# EAGLE design SignalMast-ColorLight-Dwarf (EAGLE 7.7.0)
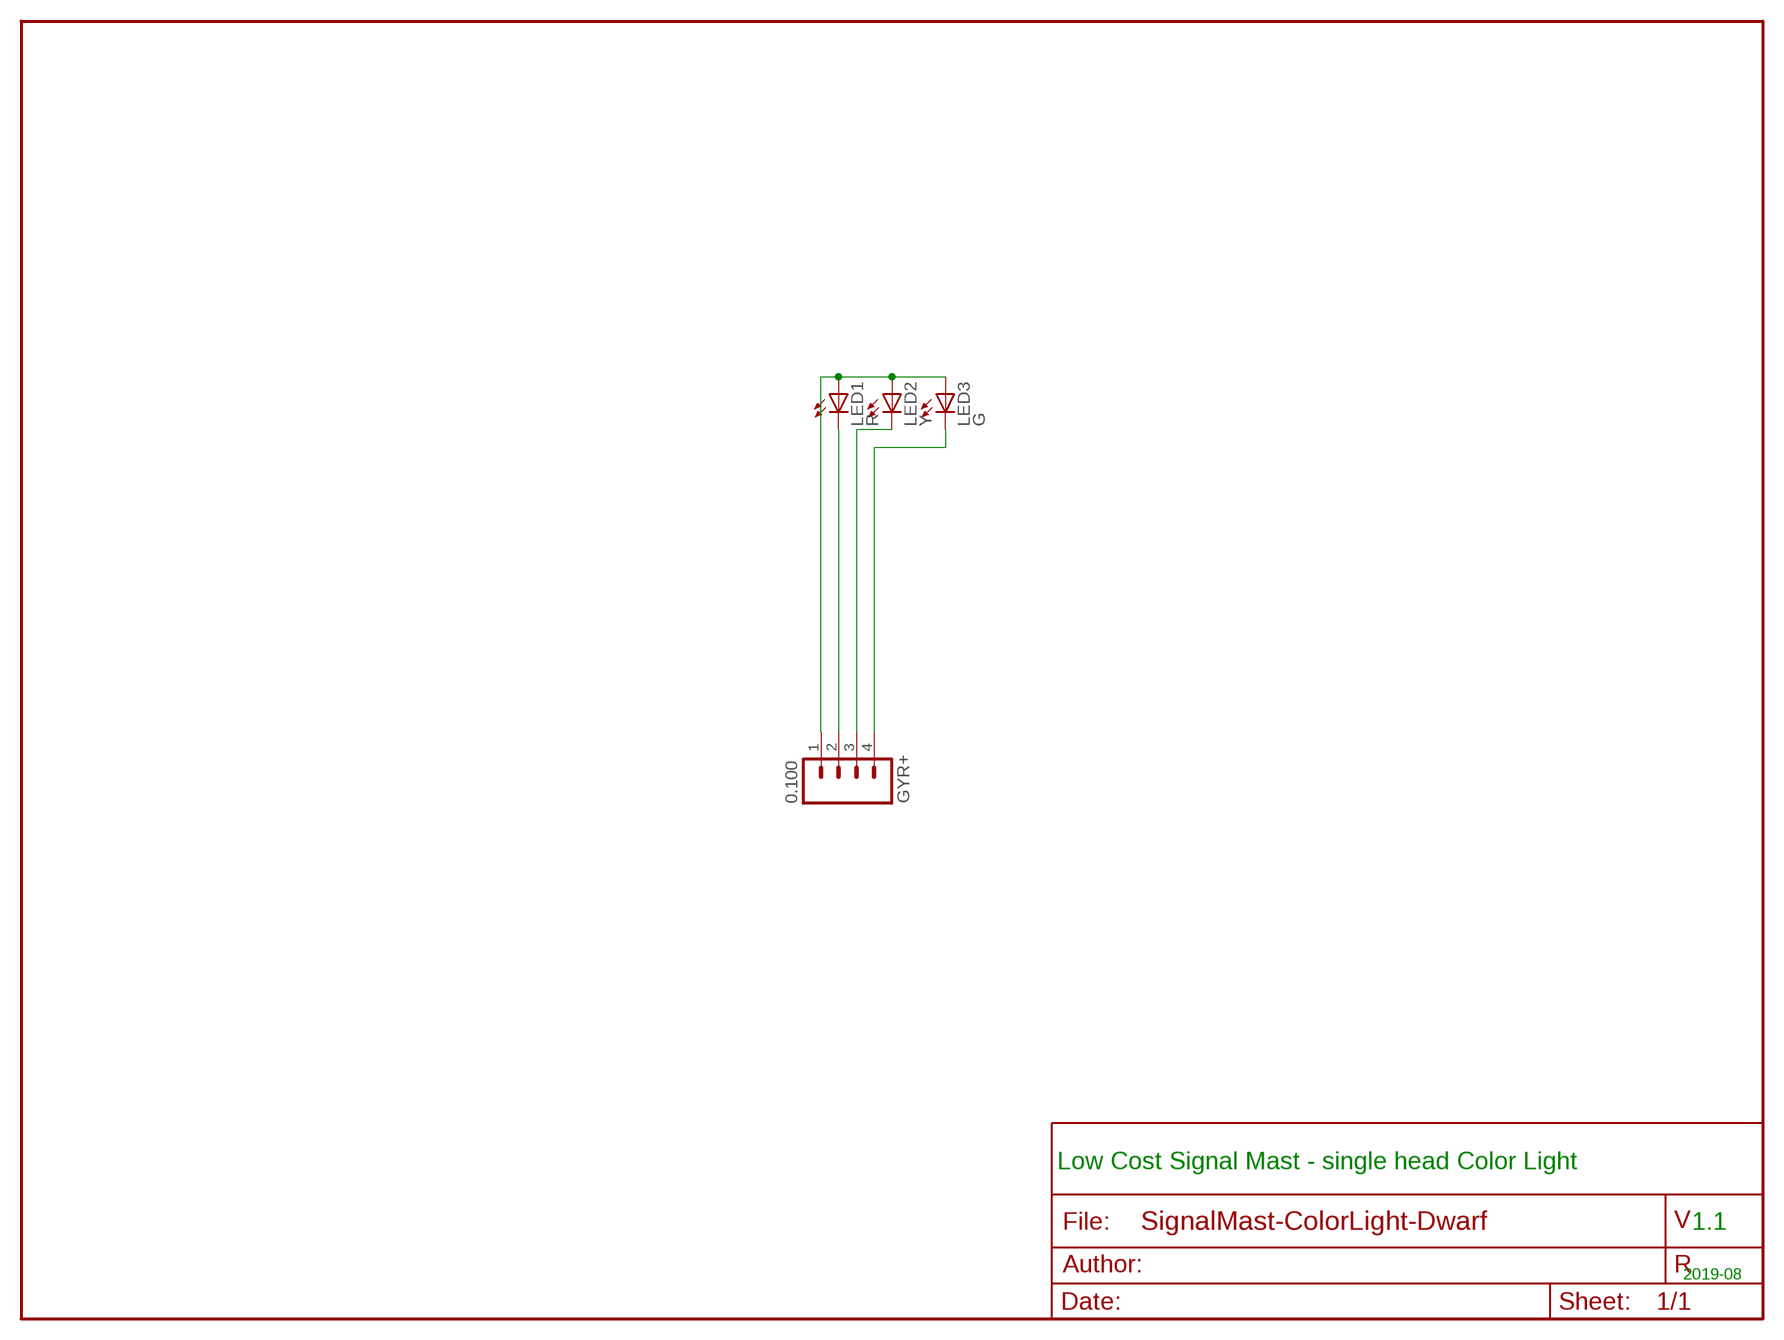
[diagram p0: schematic, sheet 1]

## Parts
GYR+  0.100  CONNECTOR-M04LOCK  [1X04_LOCK]
LED1  R  LED0603-LED  [0603-LED]
LED2  Y  LED0603-LED  [0603-LED]
LED3  G  LED0603-LED  [0603-LED]

## Nets
BG: GYR+.4 LED3.C
BR: GYR+.2 LED1.C
BV+: GYR+.1 LED1.A LED2.A LED3.A
BY: GYR+.3 LED2.C

## Notes on the sheet
- Low Cost Signal Mast - single head Color Light
- 1.1
- 2019-08

## Library data of the parts
GYR+ = SPCoast:CONNECTOR-M04: Header 4 Standard 4-pin 0.1" header. Use with straight break away headers (SKU : PRT-00116), right angle break away headers (PRT-00553), swiss pins (PRT-00743), machine pins (PRT-00117), and female headers (PRT-00115). Molex polarized connector foot print use with SKU : PRT-08231 with associated crimp pins and housings. 1MM SMD Version SKU: PRT-10208
LED1 = SPCoast:LED*; OPL: 19-217-R6C-AL1M2VY-3T
LED2 = SPCoast:LED*; OPL: 19-217-Y5C-AM1N1VY-3T
LED3 = SPCoast:LED*; OPL: 19-217-G7C-AN1P2-3T

## Net classes
0 default: width 0.203 mm

## Board
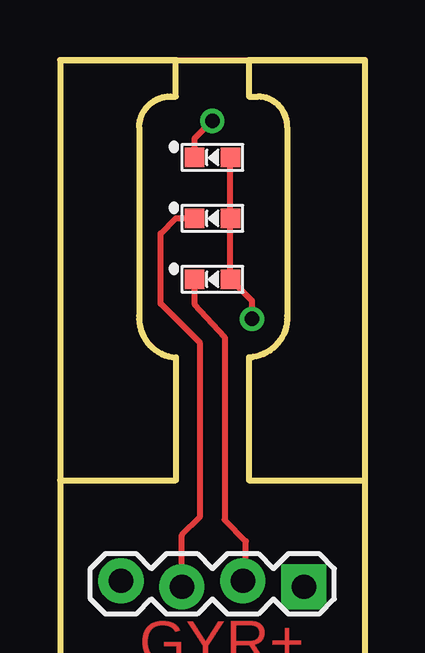
[diagram p1: board, top side]
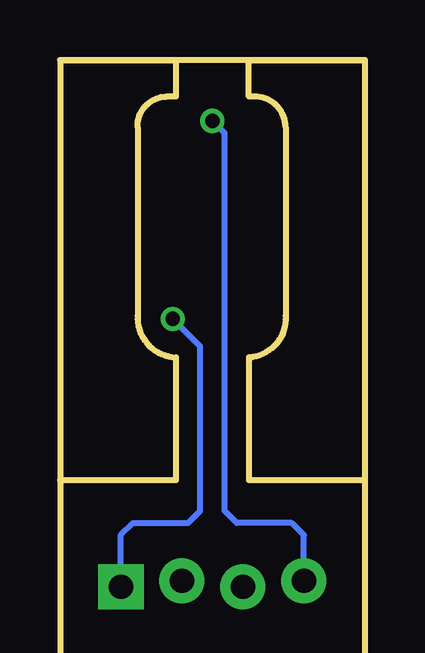
[diagram p2: board, bottom side, seen from below]

Size 12.7 x 17.53 mm. Coordinates in mm from the lower left corner, seen from the top.
Outline: 9.47,6.86 arc-90 7.87,5.12 7.87,0 12.7,0 12.7,17.53 7.87,17.53 7.87,16 8.26,16 arc-90 9.47,14.73 9.47,6.86
Outline: 3.3,14.73 3.3,6.86 arc90 4.83,5.12 4.83,0 0,0 0,17.53 4.83,17.53 4.83,16 4.6,16 arc90 3.3,14.73
Copper layers (1*16): Top 0.035mm / dielectric 1.5mm / Bottom 0.035mm
Design rules "default": minimum track width 10mil, minimum drill 24mil, track to track 8mil, track to pad 8mil, pad to pad 8mil, via to via 8mil, smd to smd 8mil, copper to edge 40mil, drill to drill 8mil, minimum pad ring 10mil, minimum via ring 8mil, stop-mask expansion 4mil, vias tented up to drill 0mil, thermal gap 10mil
Milling: 4 lines

### Footprints (pad centres in the part's own frame; a part is rotated, then mirrored left to right if it is on the bottom)
1X04_LOCK = drill 1.016 pad 1.88 square: 1 0,0.127 | drill 1.016 pad 1.88: 2 2.54,-0.127; 3 5.08,0.127; 4 7.62,-0.127
0603-LED = smd 0.8 x 0.8: A 0.75,0; C -0.75,0

### Placement (x,y rotation side)
GYR+  10.16,-4.32 180 top  (outside the outline)
LED1  6.35,8.38 0 top
LED2  6.35,10.92 0 top
LED3  6.35,13.46 0 top

### Tracks (layer width: path | path; a pad name or v marks a point on that pad's centre or on a via)
BG  (via drill 0.6)
  Top 0.254: v6.35,14.99 5.6,14.24 LED3.C
  Bottom 0.254: GYR+.4 2.54,-2.29 3.05,-1.78 5.33,-1.78 5.84,-1.27 5.84,14.48 v6.35,14.99
BR
  Top 0.254: GYR+.2 7.75,-4.06 7.75,-2.54 6.86,-1.65 6.86,5.97 5.6,7.35 LED1.C
BV+  (via drill 0.6)
  Top 0.254: v8,6.73 8,7.48 LED1.A LED2.A LED3.A
  Bottom 0.254: GYR+.1 10.16,-2.29 9.65,-1.78 7.37,-1.78 6.86,-1.27 6.86,5.59 v8,6.73
BY
  Top 0.254: GYR+.3 5.08,-2.29 5.84,-1.52 5.84,5.71 4.19,7.37 4.19,10.29 4.83,10.92 LED2.C

### Text on the board
Top: GYR+